# Altium project Top Layer.PrjPCB
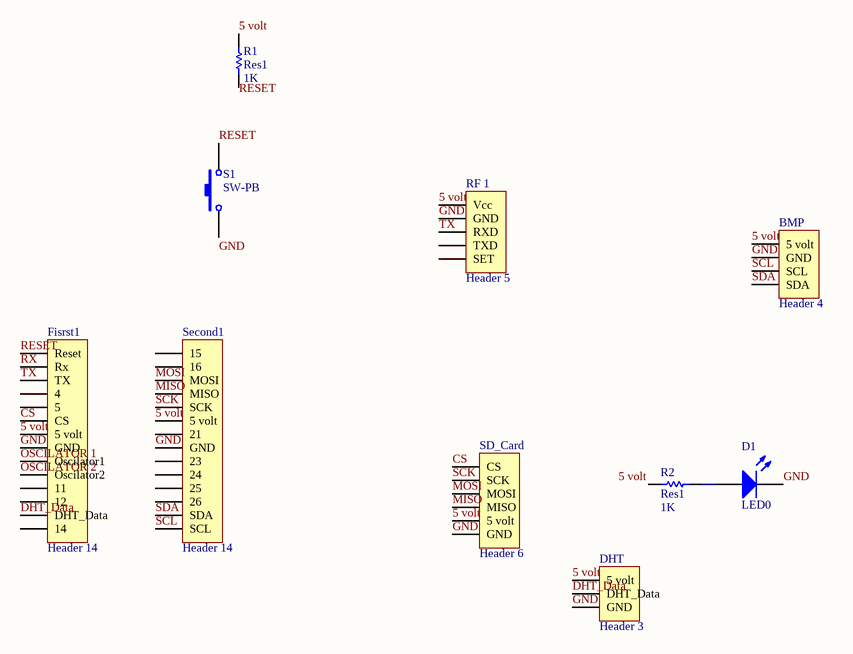
[diagram p0: Top Layer.SchDoc]
1 sheet, 10 parts. Net scope: global (net labels, ports and power ports of the same name join across sheets).
Board file: Top Layer.PcbDoc

## Sheet Top Layer.SchDoc
size A

### Parts
BMP  Header 4  [HDR1X4]
D1  LED0  [LED-0]
DHT  Header 3  [HDR1X3]
Fisrst1  Header 14  [HDR1X14]
R1  Res1  value 1K  [AXIAL-0.3]
R2  Res1  value 1K  [AXIAL-0.3]
RF_1  Header 5  [HDR1X5]
S1  SW-PB  [SPST-2]
SD_Card  Header 6  [HDR1X6]
Second1  Header 14  [HDR1X14]

### Nets
5 volt: BMP.1(5_volt) DHT.1(5_volt) Fisrst1.7(5_volt) R1.2 R2.1 RF_1.1(Vcc) SD_Card.5(5_volt) Second1.6(5_volt)
CS: Fisrst1.6(CS) SD_Card.1(CS)
DHT_Data: DHT.2(DHT_Data) Fisrst1.13(DHT_Data)
GND: BMP.2(GND) D1.2(K) DHT.3(GND) Fisrst1.8(GND) RF_1.2(GND) S1.1 SD_Card.6(GND) Second1.8(GND)
MISO: SD_Card.4(MISO) Second1.4(MISO)
MOSI: SD_Card.3(MOSI) Second1.3(MOSI)
OSCILATOR 1: Fisrst1.9(Oscilator1)
OSCILATOR 2: Fisrst1.10(Oscilator2)
RESET: Fisrst1.1(Reset) R1.1 S1.2
RX: Fisrst1.2(Rx)
SCK: SD_Card.2(SCK) Second1.5(SCK)
SCL: BMP.3(SCL) Second1.14(SCL)
SDA: BMP.4(SDA) Second1.13(SDA)
TX: Fisrst1.3(TX) RF_1.3(RXD)
NetD1_1: D1.1(A) R2.2

Not connected (* = marked no-connect by the designer): Fisrst1 4 5 11 12 14; RF_1 4(TXD) 5(SET); Second1 1(15) 2(16) 7(21) 9(23) 10(24) 11(25) 12(26)

### Library data of the parts
BMP = Header 4: Header, 4-Pin; LatestRevisionDate: 17-Jul-2002; LatestRevisionNote: Re-released for DXP Platform.; Publisher: Altium Limited
D1 = LED0: Typical INFRARED GaAs LED; Published: 8-Jun-2000; LatestRevisionDate: 08-Jul-2005; LatestRevisionNote: Mech Layer 1 removed.; PackageReference: LED-0; Publisher: Altium Limited; PackageDescription: LED; 2 Leads
DHT = Header 3: Header, 3-Pin; LatestRevisionDate: 17-Jul-2002; LatestRevisionNote: Re-released for DXP Platform.; Publisher: Altium Limited
Fisrst1 Second1 = Header 14: Header, 14-Pin; LatestRevisionDate: 17-Jul-2002; LatestRevisionNote: Re-released for DXP Platform.; Publisher: Altium Limited
R1 R2 = Res1: Resistor; Published: 8-Jun-2000; LatestRevisionDate: 17-Jul-2002; LatestRevisionNote: Re-released for DXP Platform.; PackageReference: AXIAL-0.3; Publisher: Altium Limited; PackageDescription: Axial Device, Thru-Hole; 2 Leads; 0.3 in Pin Spacing
RF_1 = Header 5: Header, 5-Pin; LatestRevisionDate: 17-Jul-2002; LatestRevisionNote: Re-released for DXP Platform.; Publisher: Altium Limited
S1 = SW-PB: Switch; Published: 24-Mar-1999; LatestRevisionDate: 17-Jul-2002; LatestRevisionNote: Re-released for DXP Platform.; PackageReference: SPST-2; Publisher: Altium Limited; PackageDescription: Switch; 2 Leads
SD_Card = Header 6: Header, 6-Pin; LatestRevisionDate: 17-Jul-2002; LatestRevisionNote: Re-released for DXP Platform.; Publisher: Altium Limited